# Altium schematic sheet Receiver.SchDoc
size A4; SheetNumber: 1; SheetTotal: 1; SPICEModelCacheURACZJYY: <root> / <DocumentId>URACZJYY</DocumentId> / </root>
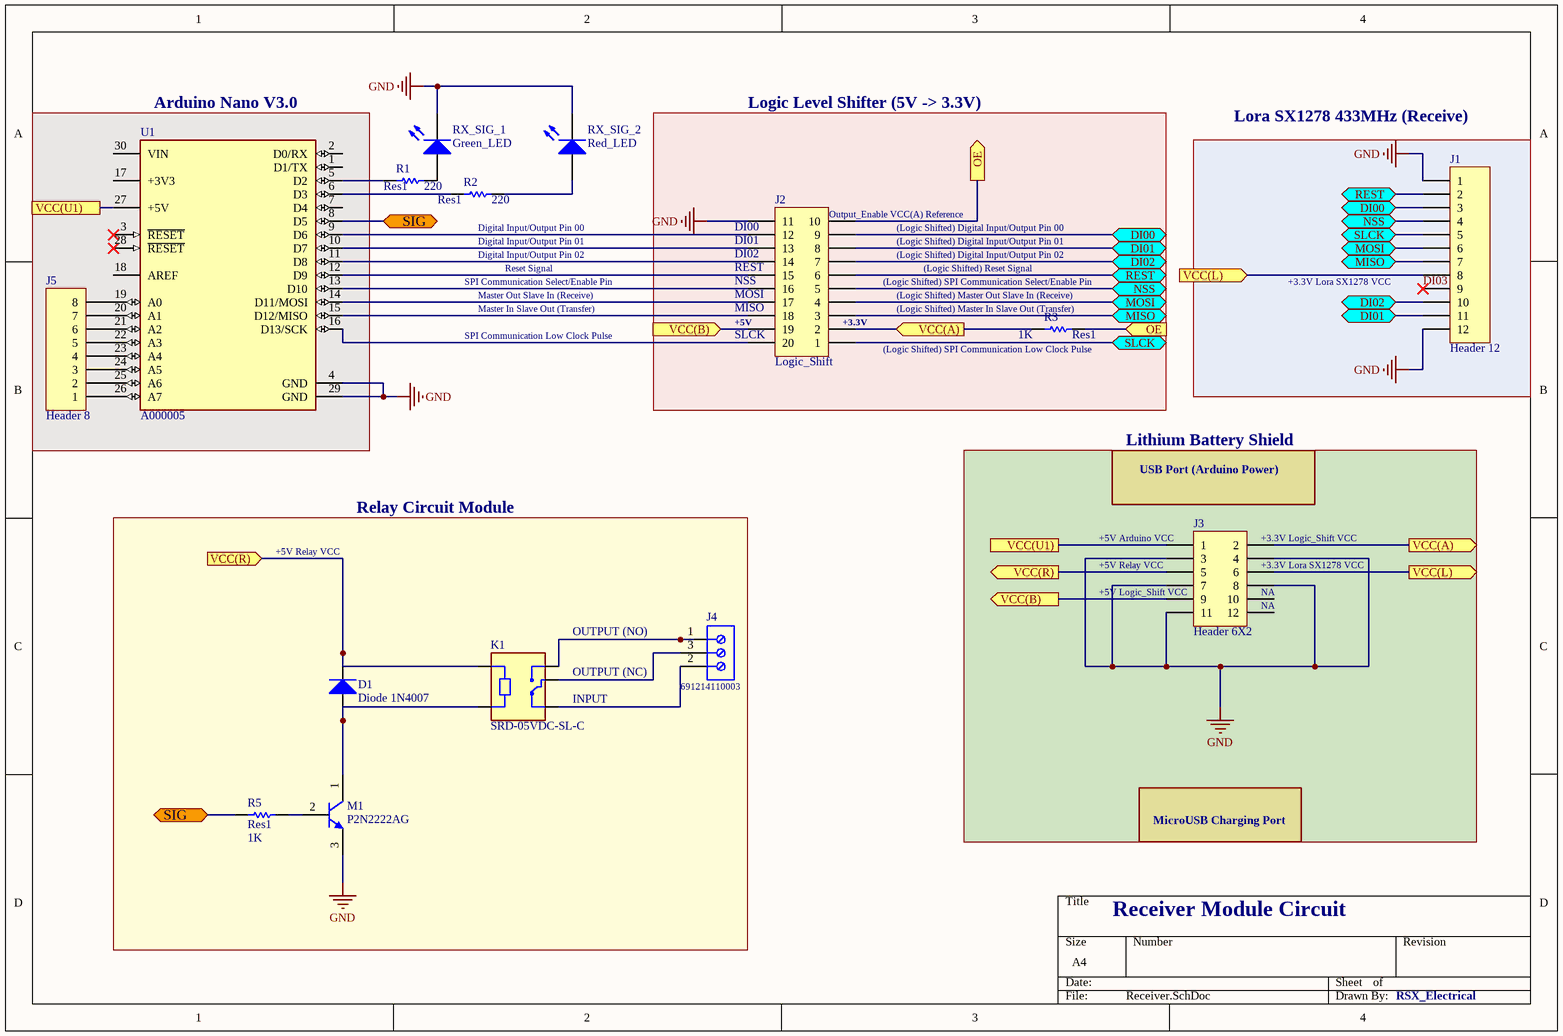
[diagram p0: Receiver.SchDoc]

## Parts
D1  Diode 1N4007  [DO-41]
J1  Header 12  [LORA Sx1278]
J2  Logic_Shift  [DIP2SSOP20]
J3  Header 6X2  [3.3V/5V Battery Shield]
J4  691214110003  [691214110003]
J5  Header 8  [HDR1X8]
K1  SRD-05VDC-SL-C  [RELAY_SRD-05VDC-SL-C]
M1  P2N2222AG  [ONSC-TO-92-3-29-11]
R1  Res1  value 220  [AXIAL-0.3]
R2  Res1  value 220  [AXIAL-0.3]
R3  Res1  value 1K  [AXIAL-0.3]
R5  Res1  value 1K  [AXIAL-0.3]
RX_SIG_1  Green_LED  [LED-0]
RX_SIG_2  Red_LED  [LED-0]
U1  A000005  [FP-A000005-MFG]

## Blocks framed on the sheet
Arduino Nano V3.0: J5 U1
Logic Level Shifter (5V -> 3.3V): J2 R3
Lora SX1278 433MHz (Receive): J1
Lithium Battery Shield: J3
Relay Circuit Module: D1 J4 K1 M1 R5

## Ports
DI00 (bidir), DI01 (bidir), DI02 (bidir), MISO (bidir), MOSI (bidir), NSS (bidir), OE (in), OE (out), REST (bidir), SIG (bidir), SLCK (bidir), VCC(A) (in), VCC(A) (out), VCC(B) (in), VCC(B) (out), VCC(L) (in), VCC(L) (out), VCC(R) (in), VCC(R) (out), VCC(U1)

## Nets
GND: J1.1 J1.12 J2.11 J3.3 J3.4 J3.7 J3.8 J3.11 M1.3(E) RX_SIG_1.2(K) RX_SIG_2.2(K) U1.4(GND) U1.29(GND)
DI00: J1.3 J2.9 ; port DI00
DI01: J1.11 J2.8 ; port DI01
DI02: J1.10 J2.7 ; port DI02
DI03: J1.9
MISO: J1.7 J2.3 ; port MISO
MOSI: J1.6 J2.4 ; port MOSI
NSS: J1.4 J2.5 ; port NSS
OE: J2.10 R3.1 ; port OE
REST: J1.2 J2.6 ; port REST
SIG: R5.1 U1.8(D5) ; port SIG
SLCK: J1.5 J2.1 ; port SLCK
VCC(A): J2.2 J3.2 R3.2 ; port VCC(A)
VCC(B): J2.19 J3.9 ; port VCC(B)
VCC(L): J1.8 J3.6 ; port VCC(L)
VCC(R): D1.2(K) J3.5 K1.A1 ; port VCC(R)
VCC(U1): J3.1 U1.27(+5V) ; port VCC(U1)
NetD1_1: D1.1(A) K1.A2 M1.1(C)
NetJ2_12: J2.12 U1.9(D6)
NetJ2_13: J2.13 U1.10(D7)
NetJ2_14: J2.14 U1.11(D8)
NetJ2_15: J2.15 U1.12(D9)
NetJ2_16: J2.16 U1.13(D10)
NetJ2_17: J2.17 U1.14(D11/MOSI)
NetJ2_18: J2.18 U1.15(D12/MISO)
NetJ2_20: J2.20 U1.16(D13/SCK)
NetJ4_1: J4.1 K1.NO
NetJ4_2: J4.2 K1.NC
NetJ4_3: J4.3 K1.COM
NetJ5_1: J5.1 U1.26(A7)
NetJ5_2: J5.2 U1.25(A6)
NetJ5_3: J5.3 U1.24(A5)
NetJ5_4: J5.4 U1.23(A4)
NetJ5_5: J5.5 U1.22(A3)
NetJ5_6: J5.6 U1.21(A2)
NetJ5_7: J5.7 U1.20(A1)
NetJ5_8: J5.8 U1.19(A0)
NetM1_2: M1.2(B) R5.2
NetR1_1: R1.1 RX_SIG_1.1(A)
NetR1_2: R1.2 U1.5(D2)
NetR2_1: R2.1 RX_SIG_2.1(A)
NetR2_2: R2.2 U1.6(D3)

Not connected (* = marked no-connect by the designer): J3 10 12; U1 1(D1/TX) 2(D0/RX) 3(~{RESET})* 7(D4) 17(+3V3) 18(AREF) 28(~{RESET})* 30(VIN)

## Notes on the sheet
- (near R2) Digital Input/Output Pin 00
- (near R2) Digital Input/Output Pin 01
- (near J2) DI00
- (near J2) DI01
- (near J2) Output_Enable VCC(A) Reference
- (Logic Shifted) Digital Input/Output Pin 00
- (Logic Shifted) Digital Input/Output Pin 01
- SPI Communication Select/Enable Pin
- Digital Input/Output Pin 02
- Master Out Slave In (Receive)
- Master In Slave Out (Transfer)
- Reset Signal
- (near J2) DI02
- (near J2) REST
- (near J2) NSS
- (near J2) MOSI
- (near J2) MISO
- (Logic Shifted) SPI Communication Select/Enable Pin
- (Logic Shifted) Digital Input/Output Pin 02
- (near R3) (Logic Shifted) Master Out Slave In (Receive)
- (near R3) (Logic Shifted) Master In Slave Out (Transfer)
- (Logic Shifted) Reset Signal
- +3.3V Lora SX1278 VCC
- SPI Communication Low Clock Pulse
- (near J2) +5V
- (near J2) SLCK
- (near J2) +3.3V
- (near R3) (Logic Shifted) SPI Communication Low Clock Pulse
- USB Port (Arduino Power)
- +5V Relay VCC
- (near J3) +5V Relay VCC
- (near J3) +5V Arduino VCC
- (near J3) +3.3V Logic_Shift VCC
- (near J3) +3.3V Lora SX1278 VCC
- (near K1) OUTPUT (NO)
- (near J3) +5V Logic_Shift VCC
- (near J3) NA
- (near K1) INPUT
- (near K1) OUTPUT (NC)
- MicroUSB Charging Port
- Receiver Module Circuit
- RSX_Electrical

## Library data of the parts
D1 = Diode 1N4007: 1 Amp General Purpose Rectifier; Published: 8-Jun-2000; LatestRevisionDate: 17-Jul-2002; LatestRevisionNote: Re-released for DXP Platform.; DatasheetVersion: 1998; PackageVersion: Aug-1999; PackageReference: DO-41; Publisher: Altium Limited; PackageDescription: Diode, Axial; Body 5.2 x 2.7 mm (LxDia. max), Lead Dia. 0.86 mm (max); Code_JEDEC: DO-204-AL; ComponentLink1Description: Manufacturer Link; ComponentLink1URL: http://www.fairchildsemi.com/; ComponentLink2Description: Datasheet; ComponentLink2URL: http://www.fairchildsemi.com/ds/1N%2F1N4001.pdf
J1 = Header 12: Header, 12-Pin; LatestRevisionDate: 17-Jul-2002; LatestRevisionNote: Re-released for DXP Platform.; Publisher: Altium Limited
J2 = Header 10X2: Header, 10-Pin, Dual row; LatestRevisionDate: 17-Jul-2002; LatestRevisionNote: Re-released for DXP Platform.; Publisher: Altium Limited
J3 = Header 6X2: Header, 6-Pin, Dual row; LatestRevisionDate: 17-Jul-2002; LatestRevisionNote: Re-released for DXP Platform.; Publisher: Altium Limited
J4 = CMP-1502-02466-1: Serie 2141 - 3.50 mm Horizontal Entry Modular with Rising Cage Clamp WR-TBL, 3 pin; Manufacturer: Wurth Elektronik; Pin Number: 3; Pitch: 3.50mm; Package Reference: 691214110003; Mounting Technology: THT; Part Number: 691214110003; Manufacturer URL: http://www.we-online.de; Packaging: Box; Operating Temperature: -40to105degC; Publisher: WurthElektronik; Datasheet URL: http://katalog.we-online.de/em/datasheet/6912141100xx.pdf
J5 = Header 8: Header, 8-Pin; LatestRevisionDate: 17-Jul-2002; LatestRevisionNote: Re-released for DXP Platform.; Publisher: Altium Limited
K1 = SRD-05VDC-SL-C: 5V Trigger Relay Module For Arduino And Raspberry Pi 5V Trigger Relay Module For Arduino And Raspberry Pi; MF: Songle Relay; Value: *; Price: None; Package: NON STANDARD-5 Songle Relay; Availability: Not in stock; Check_prices: https://www.snapeda.com/parts/SRD-05VDC-SL-C/Songle+Relay/view-part/?ref=eda; MP: SRD-05VDC-SL-C; SnapEDA_Link: https://www.snapeda.com/parts/SRD-05VDC-SL-C/Songle+Relay/view-part/?ref=snap
M1 = CMP-1048-01402-1: Amplifier Transistor, NPN Silicon, 3-Pin TO-92, Pb-Free, Bulk Box; Manufacturer: On Semiconductor; IC Continuous (A): 0.6; fT Min (MHz): 300; ComponentLink2Description: Datasheet; ComponentLink1Description: Manufacturer URL; ComponentLink2URL: http://www.onsemi.com/pub_link/Collateral/P2N2222A-D.PDF; ComponentLink3Description: Package Specification; RoHS: TRUE; ComponentLink1URL: http://www.onsemi.com/; PartNumber: P2N2222AG; Mounting Technology: Through Hole; PackageReference: TO-92-3-29-11_AM_SL; Polarity: NPN; Packing: Bulk Box; DatasheetVersion: Rev. 7; PackageDescription: 3-Pin Transistor Outline, Body 4.825 x 3.685 mm, Pitch 1.27 mm; PackageVersion: Rev. AM; ComponentLink3URL: http://www.onsemi.cn/pub_link/Collateral/2N6426-D.PDF
R1-R3 R5 = Res1: Resistor; Published: 8-Jun-2000; LatestRevisionDate: 17-Jul-2002; LatestRevisionNote: Re-released for DXP Platform.; PackageReference: AXIAL-0.3; Publisher: Altium Limited; PackageDescription: Axial Device, Thru-Hole; 2 Leads; 0.3 in Pin Spacing
RX_SIG_1 RX_SIG_2 = LED0: Typical INFRARED GaAs LED; Published: 8-Jun-2000; LatestRevisionDate: 08-Jul-2005; LatestRevisionNote: Mech Layer 1 removed.; PackageReference: LED-0; Publisher: Altium Limited; PackageDescription: LED; 2 Leads
U1 = CMP-189986-000002-1: ARDUINO NANO ATMEGA328 EVAL BRD; Number of Bits: 8; Evaluation Kit: Yes; Operating Supply Voltage: 12V; Interface: I2C; Data Bus Width: 8b; Core Architecture: AVR; Packaging: Bulk; Length: 7inch; Package Quantity: 50; Width: 5inch; REACH SVHC: No SVHC; Weight: 0.358383oz; Series: AVR® ATmega; Height: 0.25inch